# Altium project STM32H747IGT6_IsolatedDAQ.PrjPcb
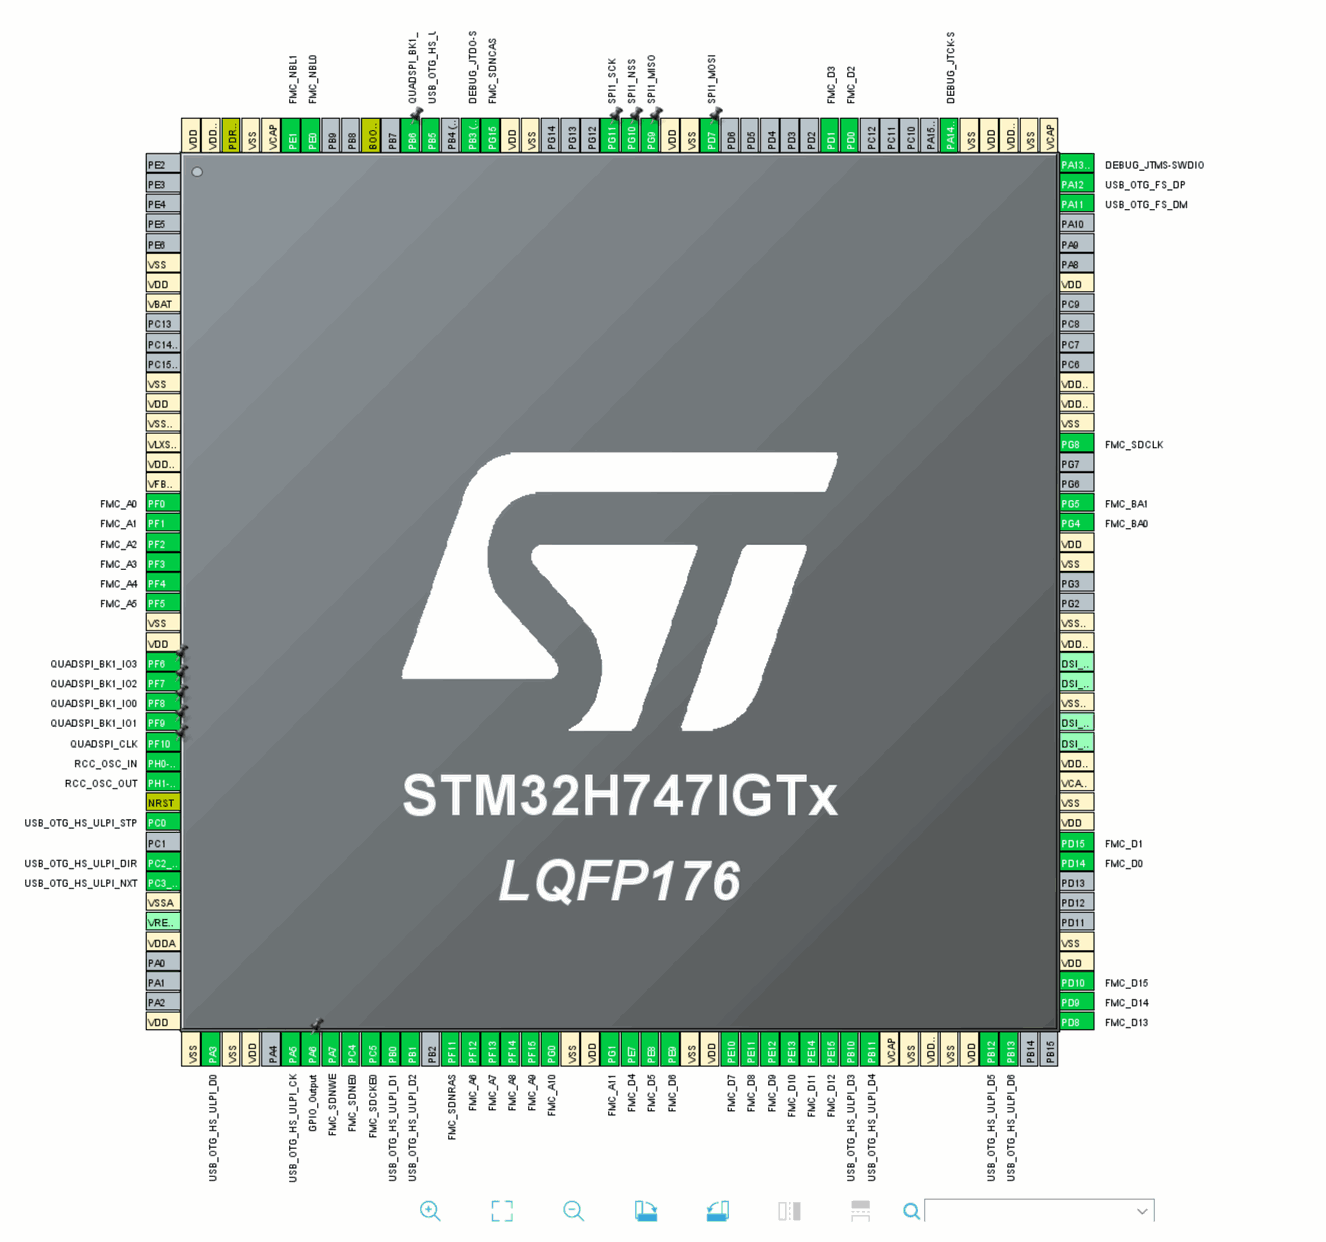
[diagram p0: MCU_Overview.SchDoc]
9 sheets, 159 parts. Net scope: global (net labels, ports and power ports of the same name join across sheets).
Board file: IsolatedDAQ.PcbDoc
Sheets:
  MCU_Overview.SchDoc
  PowerSupply.SchDoc
  Decoupling.SchDoc
  MCUConfig.SchDoc
  SDRAMModule.SchDoc
  GPIOPins.SchDoc
  USBHSULPI.SchDoc
  IsolationBarriers.SchDoc
  MultiChannelADC.SchDoc

## Sheet MCU_Overview.SchDoc
size A3; SheetNumber: 1; SheetTotal: 8

## Sheet PowerSupply.SchDoc
size A4; SheetNumber: 2; SheetTotal: 9
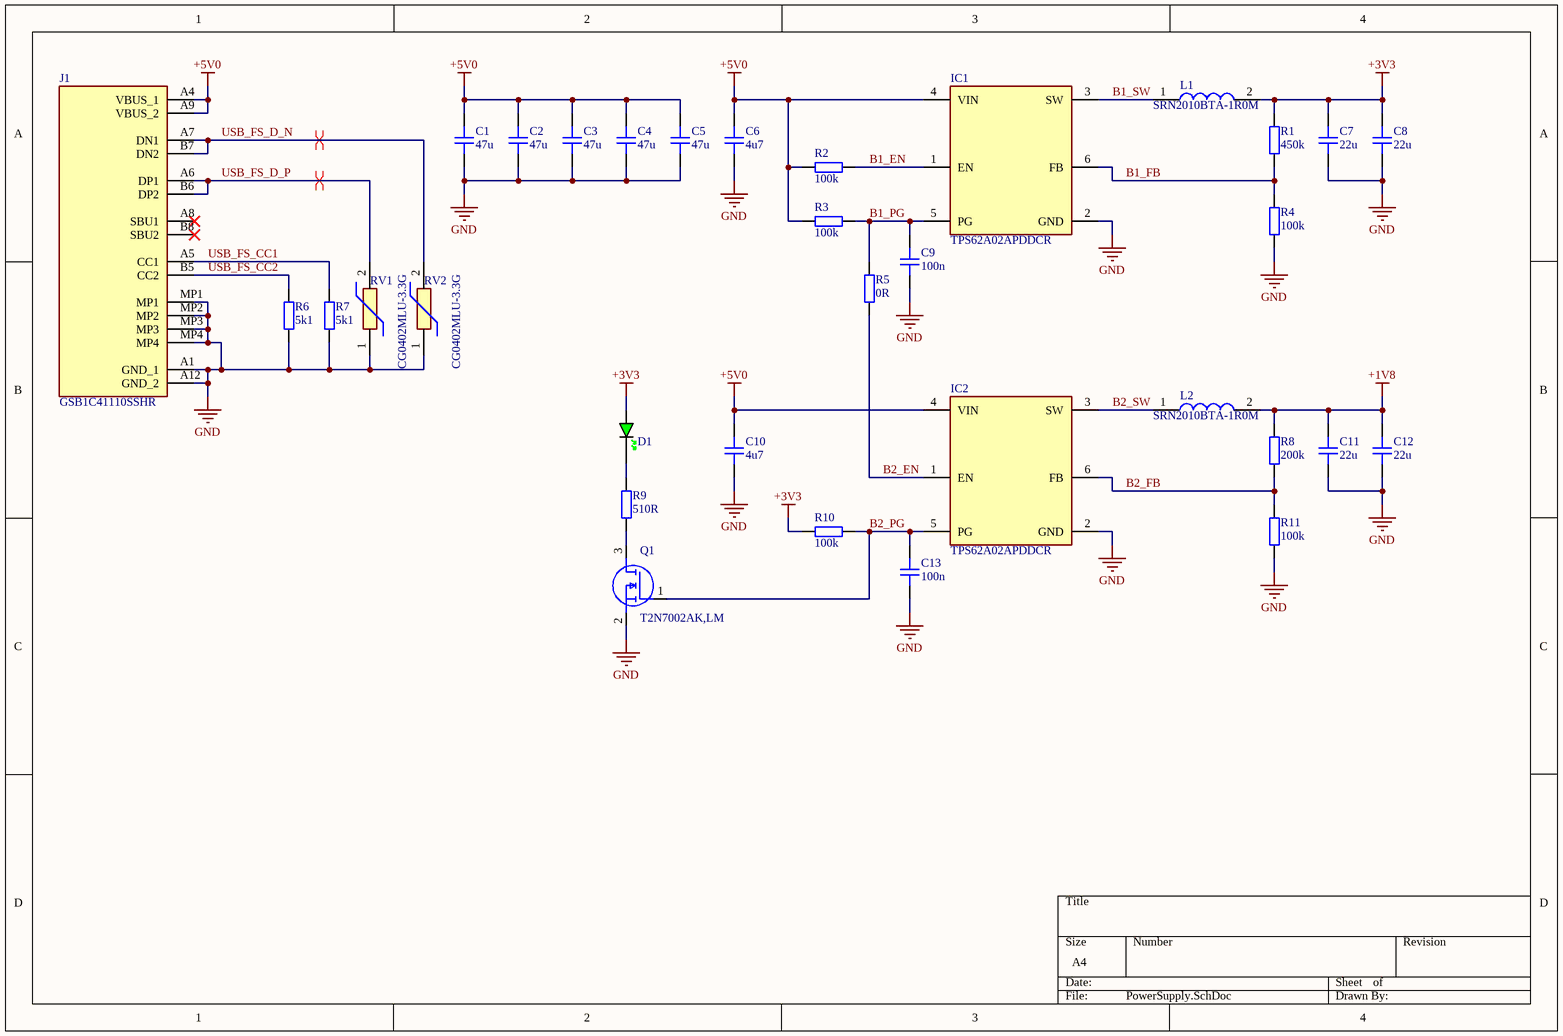
[diagram p1: PowerSupply.SchDoc]

### Parts
C1  47u  [CAP_1210]
C2  47u  [CAP_1210]
C3  47u  [CAP_1210]
C4  47u  [CAP_1210]
C5  47u  [CAP_1210]
C6  4u7  [CAP_0603]
C7  22u  [CAP_0603]
C8  22u  [CAP_0603]
C9  100n  [CAP_0402]
C10  4u7  [CAP_0603]
C11  22u  [CAP_0603]
C12  22u  [CAP_0603]
C13  100n  [CAP_0402]
D1  GREEN  [LED_0603_GREEN]  (value not drawn)
IC1  TPS62A02APDDCR  [SOT95P280X110-6N - duplicate]
IC2  TPS62A02APDDCR  [SOT95P280X110-6N - duplicate]
J1  GSB1C41110SSHR  [GSB1C41110SSHR]
L1  SRN2010BTA-1R0M  [SRN2010BTA1R0M]
L2  SRN2010BTA-1R0M  [SRN2010BTA1R0M]
Q1  T2N7002AK,LM  [TBAT54CLM]
R1  450k  [RES_0402]
R2  100k  [RES_0402]
R3  100k  [RES_0402]
R4  100k  [RES_0402]
R5  0R  [RES_0402]
R6  5k1  [RES_0402]
R7  5k1  [RES_0402]
R8  200k  [RES_0402]
R9  510R  [RES_0603]
R10  100k  [RES_0402]
R11  100k  [RES_0402]
RV1  CG0402MLU-3.3G  [VARC1005X41N]
RV2  CG0402MLU-3.3G  [VARC1005X41N]

### Nets
+1V8: C11.2 C12.2 L2.2 R8.2
+3V3: C7.2 C8.2 D1.A L1.2 R1.2 R10.1
+5V0: C1.2 C2.2 C3.2 C4.2 C5.2 C6.2 C10.2 IC1.4(VIN) IC2.4(VIN) J1.A4(VBUS_1) J1.A9(VBUS_2) R2.1 R3.1
GND: C1.1 C2.1 C3.1 C4.1 C5.1 C6.1 C7.1 C8.1 C9.1 C10.1 C11.1 C12.1 C13.1 IC1.2(GND) IC2.2(GND) J1.A1(GND_1) J1.A12(GND_2) J1.MP1 J1.MP2 J1.MP3 J1.MP4 Q1.2(S) R4.1 R6.2 R7.2 R11.1 RV1.1 RV2.1
B1_EN: IC1.1(EN) R2.2
B1_FB: IC1.6(FB) R1.1 R4.2
B1_PG: C9.2 IC1.5(PG) R3.2 R5.2
B1_SW: IC1.3(SW) L1.1
B2_EN: IC2.1(EN) R5.1
B2_FB: IC2.6(FB) R8.1 R11.2
B2_PG: C13.2 IC2.5(PG) Q1.1(G) R10.2
B2_SW: IC2.3(SW) L2.1
USB_FS_CC1: J1.A5(CC1) R7.1
USB_FS_CC2: J1.B5(CC2) R6.1
USB_FS_D_N: J1.A7(DN1) J1.B7(DN2) RV2.2
USB_FS_D_P: J1.A6(DP1) J1.B6(DP2) RV1.2
NetD1_K: D1.K R9.2
NetQ1_3: Q1.3(D) R9.1

Not connected (* = marked no-connect by the designer): J1 A8(SBU1)* B8(SBU2)*

### Layout directives
differential pair: USB_FS_D_N, USB_FS_D_P

### Library data of the parts
C1-C5 = CAP_1210: Capacitor SMD 1210; Manufacturer: *; Manufacturer Part Number: *; Distributor Link: *; LCSC: *; Rating: *; Dielectric: *
C6-C8 C10-C12 = CAP_0603: Capacitor SMD 0603; Manufacturer: *; Manufacturer Part Number: *; Distributor Link: *; LCSC: *; Rating: *; Dielectric: *
C9 C13 = CAP_0402: Capacitor SMD 0402; Manufacturer: *; Manufacturer Part Number: *; Distributor Link: *; LCSC: *; Rating: *; Dielectric: *
D1 = LED_0603_GREEN: LED 0603 GREEN SMD
IC1 IC2 = TPS62A02APDDCR: Integrated Circuit; Manufacturer_Name: Texas Instruments; Datasheet Link: https://www.ti.com/lit/ds/symlink/tps62a02a.pdf?ts=1731815729746&ref_url=https%253A%252F%252Fwww.ti.com%252Fproduct%252FTPS62A02A%252Fpart-details%252FTPS62A02APDDCR%253Futm_source%253Dgoogle%2526utm_medium%253Dcpc%2526utm_campaign%253Docb-tistore-null-ap; Height: 1.1mm; Manufacturer_Part_Number: TPS62A02APDDCR; Mouser Part Number: 595-TPS62A02APDDCR; Mouser Price/Stock: https://www.mouser.co.uk/ProductDetail/Texas-Instruments/TPS62A02APDDCR?qs=ZcfC38r4PotJY8Nb5BNo3Q%3D%3D; Arrow Part Number: TPS62A02APDDCR; Arrow Price/Stock: https://www.arrow.com/en/products/tps62a02apddcr/texas-instruments?utm_currency=USD&region=nac
J1 = GSB1C41110SSHR: Connector; Manufacturer_Name: Amphenol Communications Solutions; Datasheet Link: https://cdn.amphenol-cs.com/media/wysiwyg/files/drawing/gsb1c41x10sshr-ax1.pdf; Height: 3.41mm; Manufacturer_Part_Number: GSB1C41110SSHR
L1 L2 = SRN2010BTA-1R0M: Inductor; Manufacturer_Name: Bourns; Datasheet Link: https://www.bourns.com/docs/Product-Datasheets/SRN2010BTA.pdf; Height: 1mm; Manufacturer_Part_Number: SRN2010BTA-1R0M
Q1 = T2N7002AK,LM: MOSFET (N-Channel); Manufacturer_Name: Toshiba; Datasheet Link: http://toshiba.semicon-storage.com/info/docget.jsp?did=29712&prodName=T2N7002AK; Height: 1.1mm; Manufacturer_Part_Number: T2N7002AK,LM; Mouser Part Number: 757-T2N7002AKLM; Mouser Price/Stock: https://www.mouser.co.uk/ProductDetail/Toshiba/T2N7002AKLM?qs=pzVvXTvk9PzfX4hYglwZ9Q%3D%3D; Arrow Part Number: T2N7002AK,LM; Arrow Price/Stock: https://www.arrow.com/en/products/t2n7002aklm/toshiba?region=nac
R1-R8 R10 R11 = RES_0402: Resistor SMD 0402; Manufacturer: *; Manufacturer Part Number: *; Distributor Link: *; LCSC: *
R9 = RES_0603: Resistor SMD 0603; Manufacturer: *; Manufacturer Part Number: *; Distributor Link: *; LCSC: *
RV1 RV2 = CG0402MLU-3.3G: ESD Diode; Manufacturer_Name: Bourns; Datasheet Link: https://www.bourns.com/docs/Product-Datasheets/MLU.pdf; Height: 0.41mm; Manufacturer_Part_Number: CG0402MLU-3.3G; Mouser Part Number: 652-CG0402MLU-3.3G; Mouser Price/Stock: https://www.mouser.co.uk/ProductDetail/Bourns/CG0402MLU-3.3G?qs=m8myXnDJXpWVM8EQWErxtQ%3D%3D; Arrow Part Number: CG0402MLU-3.3G; Arrow Price/Stock: https://www.arrow.com/en/products/cg0402mlu-3.3g/bourns?utm_currency=USD&region=nac

## Sheet Decoupling.SchDoc
size A4; SheetNumber: 3; SheetTotal: 8
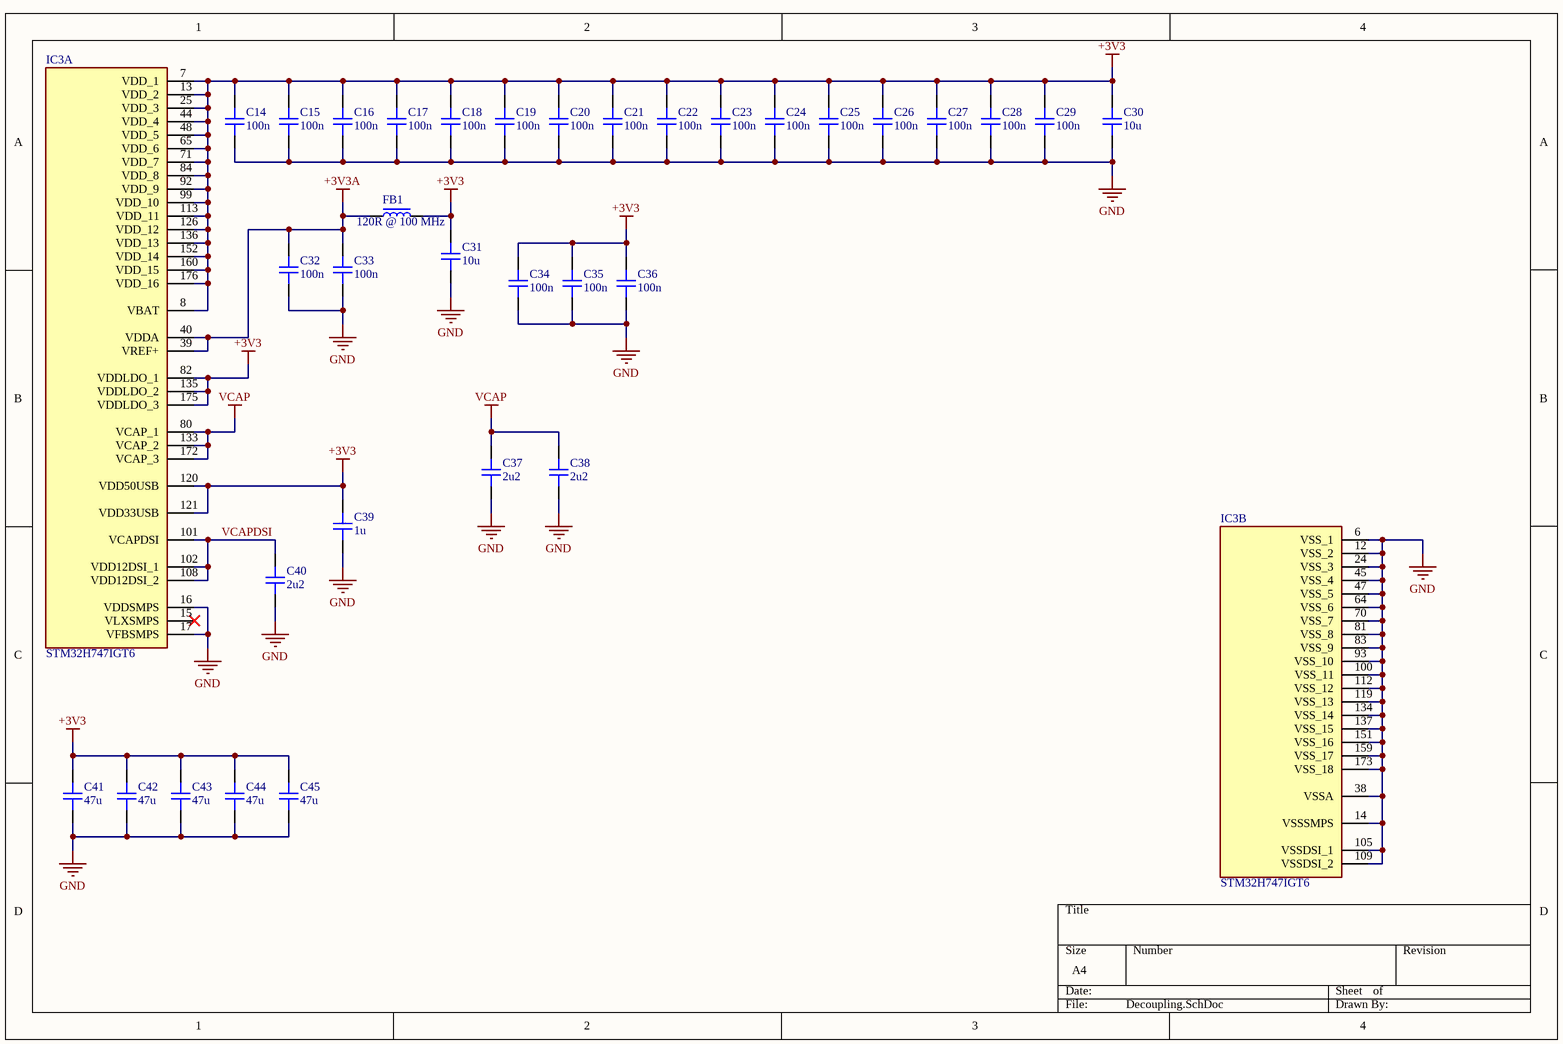
[diagram p2: Decoupling.SchDoc]

### Parts
C14  100n  [CAP_0402]
C15  100n  [CAP_0402]
C16  100n  [CAP_0402]
C17  100n  [CAP_0402]
C18  100n  [CAP_0402]
C19  100n  [CAP_0402]
C20  100n  [CAP_0402]
C21  100n  [CAP_0402]
C22  100n  [CAP_0402]
C23  100n  [CAP_0402]
C24  100n  [CAP_0402]
C25  100n  [CAP_0402]
C26  100n  [CAP_0402]
C27  100n  [CAP_0402]
C28  100n  [CAP_0402]
C29  100n  [CAP_0402]
C30  10u  [CAP_0603]
C31  10u  [CAP_0603]
C32  100n  [CAP_0402]
C33  100n  [CAP_0402]
C34  100n  [CAP_0402]
C35  100n  [CAP_0402]
C36  100n  [CAP_0402]
C37  2u2  [CAP_0402]
C38  2u2  [CAP_0402]
C39  1u  [CAP_0402]
C40  2u2  [CAP_0402]
C41  47u  [CAP_1210]
C42  47u  [CAP_1210]
C43  47u  [CAP_1210]
C44  47u  [CAP_1210]
C45  47u  [CAP_1210]
FB1  120R @ 100 MHz  [FB_0402]
IC3  STM32H747IGT6  [QFP50P2600X2600X160-176N]  (parts A,B of 10)

### Nets
+3V3: C14.2 C15.2 C16.2 C17.2 C18.2 C19.2 C20.2 C21.2 C22.2 C23.2 C24.2 C25.2 C26.2 C27.2 C28.2 C29.2 C30.2 C31.2 C34.2 C35.2 C36.2 C39.2 C41.2 C42.2 C43.2 C44.2 C45.2 FB1.2 IC3.7(VDD_1) IC3.8(VBAT) IC3.13(VDD_2) IC3.25(VDD_3) IC3.44(VDD_4) IC3.48(VDD_5) IC3.65(VDD_6) IC3.71(VDD_7) IC3.82(VDDLDO_1) IC3.84(VDD_8) IC3.92(VDD_9) IC3.99(VDD_10) IC3.113(VDD_11) IC3.120(VDD50USB) IC3.121(VDD33USB) IC3.126(VDD_12) IC3.135(VDDLDO_2) IC3.136(VDD_13) IC3.152(VDD_14) IC3.160(VDD_15) IC3.175(VDDLDO_3) IC3.176(VDD_16)
+3V3A: C32.2 C33.2 FB1.1 IC3.39(VREF+) IC3.40(VDDA)
GND: C14.1 C15.1 C16.1 C17.1 C18.1 C19.1 C20.1 C21.1 C22.1 C23.1 C24.1 C25.1 C26.1 C27.1 C28.1 C29.1 C30.1 C31.1 C32.1 C33.1 C34.1 C35.1 C36.1 C37.1 C38.1 C39.1 C40.1 C41.1 C42.1 C43.1 C44.1 C45.1 IC3.6(VSS_1) IC3.12(VSS_2) IC3.14(VSSSMPS) IC3.16(VDDSMPS) IC3.17(VFBSMPS) IC3.24(VSS_3) IC3.38(VSSA) IC3.45(VSS_4) IC3.47(VSS_5) IC3.64(VSS_6) IC3.70(VSS_7) IC3.81(VSS_8) IC3.83(VSS_9) IC3.93(VSS_10) IC3.100(VSS_11) IC3.105(VSSDSI_1) IC3.109(VSSDSI_2) IC3.112(VSS_12) IC3.119(VSS_13) IC3.134(VSS_14) IC3.137(VSS_15) IC3.151(VSS_16) IC3.159(VSS_17) IC3.173(VSS_18)
VCAP: C37.2 C38.2 IC3.80(VCAP_1) IC3.133(VCAP_2) IC3.172(VCAP_3)
VCAPDSI: C40.2 IC3.101(VCAPDSI) IC3.102(VDD12DSI_1) IC3.108(VDD12DSI_2)

Not connected (* = marked no-connect by the designer): IC3 15(VLXSMPS)*

### Library data of the parts
C14-C29 C32-C40 = CAP_0402: Capacitor SMD 0402; Manufacturer: *; Manufacturer Part Number: *; Distributor Link: *; LCSC: *; Rating: *; Dielectric: *
C30 C31 = CAP_0603: Capacitor SMD 0603; Manufacturer: *; Manufacturer Part Number: *; Distributor Link: *; LCSC: *; Rating: *; Dielectric: *
C41-C45 = CAP_1210: Capacitor SMD 1210; Manufacturer: *; Manufacturer Part Number: *; Distributor Link: *; LCSC: *; Rating: *; Dielectric: *
FB1 = FB_0402: Ferrite Bead SMD 0402; Manufacturer: *; Manufacturer Part Number: *; Distributor Link: *; LCSC: *
IC3 = STM32H747IGT6: Integrated Circuit; Manufacturer_Name: STMicroelectronics; Datasheet Link: https://www.mouser.com/datasheet/2/389/dm00602212-1799407.pdf; Height: 1.6mm; Manufacturer_Part_Number: STM32H747IGT6; Mouser Part Number: 511-STM32H747IGT6; Mouser Price/Stock: https://www.mouser.co.uk/ProductDetail/STMicroelectronics/STM32H747IGT6?qs=%252B6g0mu59x7Kw%252BsPEalqvLg%3D%3D; Arrow Part Number: STM32H747IGT6; Arrow Price/Stock: null?region=nac

## Sheet MCUConfig.SchDoc
size A4; SheetNumber: 4; SheetTotal: 8
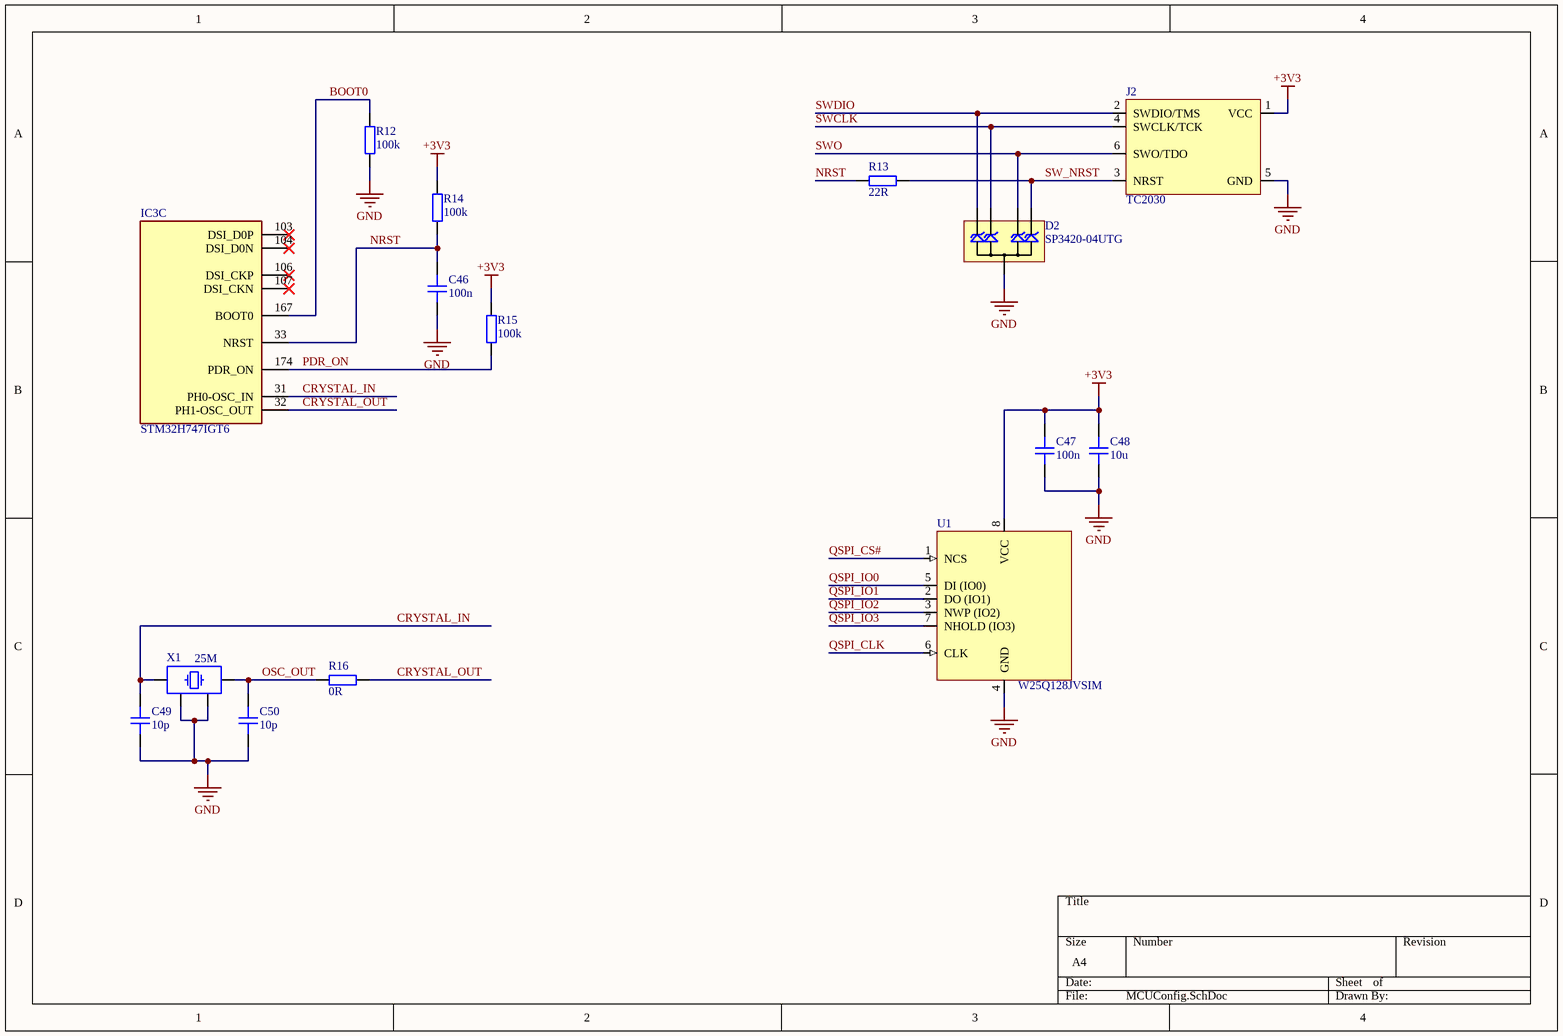
[diagram p3: MCUConfig.SchDoc]

### Parts
C46  100n  [CAP_0402]
C47  100n  [CAP_0402]
C48  10u  [CAP_0603]
C49  10p  [CAP_0402]
C50  10p  [CAP_0402]
D2  SP3420-04UTG  [uDFN-10]
IC3  STM32H747IGT6  [QFP50P2600X2600X160-176N]  (part C of 10)
J2  TC2030  [TC2030-FP]  (no BOM)
R12  100k  [RES_0402]
R13  22R  [RES_0402]
R14  100k  [RES_0402]
R15  100k  [RES_0402]
R16  0R  [RES_0402]
U1  W25Q128JVSIM  [SOIC-8]
X1  25M  [XTAL_3225]

### Nets
+3V3: C47.2 C48.2 J2.1(VCC) R14.2 R15.2 U1.8(VCC)
GND: C46.1 C47.1 C48.1 C49.1 C50.1 D2.38(GND) J2.5(GND) R12.1 U1.4(GND) X1.2 X1.4
BOOT0: IC3.167(BOOT0) R12.2
CRYSTAL_IN: C49.2 IC3.31(PH0-OSC_IN) X1.1
CRYSTAL_OUT: IC3.32(PH1-OSC_OUT) R16.2
NRST: C46.2 IC3.33(NRST) R13.2 R14.1
OSC_OUT: C50.2 R16.1 X1.3
PDR_ON: IC3.174(PDR_ON) R15.1
QSPI_CLK: U1.6(CLK)
QSPI_CS#: U1.1(NCS)
QSPI_IO0: U1.5(DI_(IO0))
QSPI_IO1: U1.2(DO_(IO1))
QSPI_IO2: U1.3(NWP_(IO2))
QSPI_IO3: U1.7(NHOLD_(IO3))
SW_NRST: D2.56 J2.3(NRST) R13.1
SWCLK: D2.29 J2.4(SWCLK/TCK)
SWDIO: D2.110 J2.2(SWDIO/TMS)
SWO: D2.47 J2.6(SWO/TDO)

Not connected (* = marked no-connect by the designer): IC3 103(DSI_D0P)* 104(DSI_D0N)* 106(DSI_CKP)* 107(DSI_CKN)*

### Library data of the parts
C46 C47 C49 C50 = CAP_0402: Capacitor SMD 0402; Manufacturer: *; Manufacturer Part Number: *; Distributor Link: *; LCSC: *; Rating: *; Dielectric: *
C48 = CAP_0603: Capacitor SMD 0603; Manufacturer: *; Manufacturer Part Number: *; Distributor Link: *; LCSC: *; Rating: *; Dielectric: *
D2 = SP3420-04UTG: TVS Diode Array Low Capacitance ESD Protection 4-Channel (Vwork=3V3, Vclamp=6V); Manufacturer: Littelfuse; Manufacturer Part Number: SP3420-04UTG
IC3 = STM32H747IGT6: as IC3 on sheet Decoupling; Datasheet Link: https://www.mouser.com/datasheet/2/389/dm00602212-1799407.pdf; Height: 1.6mm; Manufacturer_Part_Number: STM32H747IGT6; Mouser Part Number: 511-STM32H747IGT6; Mouser Price/Stock: https://www.mouser.co.uk/ProductDetail/STMicroelectronics/STM32H747IGT6?qs=%252B6g0mu59x7Kw%252BsPEalqvLg%3D%3D; Arrow Part Number: STM32H747IGT6; Arrow Price/Stock: null?region=nac
J2 = TC2030: Tag-Connect No-Solder SWD Debug Connector DO NOT PLACE; Manufacturer: Tag-Connect; Manufacturer Part Number: TC2030
R12-R16 = RES_0402: Resistor SMD 0402; Manufacturer: *; Manufacturer Part Number: *; Distributor Link: *; LCSC: *
U1 = W25Q128JVSIM: 128M-BIT / SERIAL FLASH MEMORY WITH / DUAL/QUAD SPI & QPI & DTR SOIC-8; Manufacturer: Winbond; Manufacturer Part Number: W25Q128JVSIM
X1 = XTAL_3225: Crystal SMD 3225; Distributor Link: *

## Sheet SDRAMModule.SchDoc
size A4; SheetNumber: 5; SheetTotal: 8
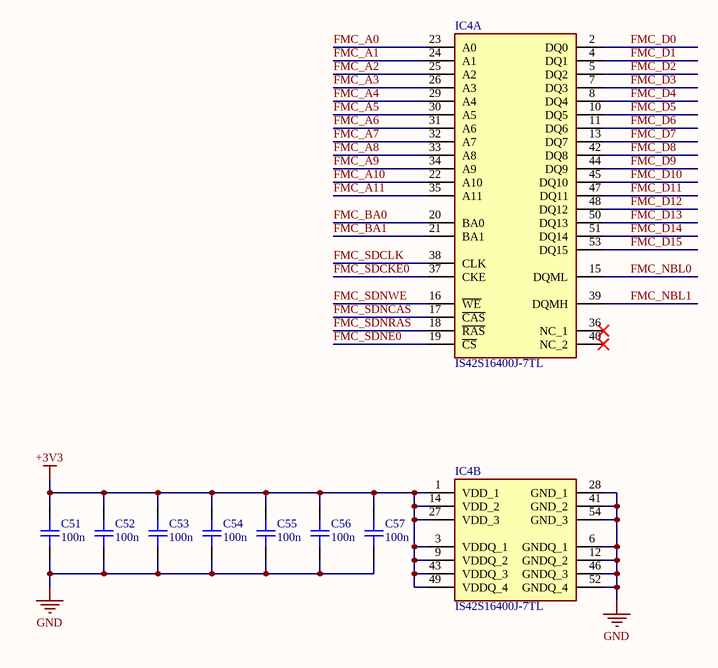
[diagram p4: SDRAMModule.SchDoc]

### Parts
C51  100n  [CAP_0402]
C52  100n  [CAP_0402]
C53  100n  [CAP_0402]
C54  100n  [CAP_0402]
C55  100n  [CAP_0402]
C56  100n  [CAP_0402]
C57  100n  [CAP_0402]
IC4  IS42S16400J-7TL  [SOP80P1176X120-54N]  (parts A,B of 2)

### Nets
+3V3: C51.2 C52.2 C53.2 C54.2 C55.2 C56.2 C57.2 IC4.1(VDD_1) IC4.3(VDDQ_1) IC4.9(VDDQ_2) IC4.14(VDD_2) IC4.27(VDD_3) IC4.43(VDDQ_3) IC4.49(VDDQ_4)
GND: C51.1 C52.1 C53.1 C54.1 C55.1 C56.1 C57.1 IC4.6(GNDQ_1) IC4.12(GNDQ_2) IC4.28(GND_1) IC4.41(GND_2) IC4.46(GNDQ_3) IC4.52(GNDQ_4) IC4.54(GND_3)
FMC_A0: IC4.23(A0)
FMC_A1: IC4.24(A1)
FMC_A2: IC4.25(A2)
FMC_A3: IC4.26(A3)
FMC_A4: IC4.29(A4)
FMC_A5: IC4.30(A5)
FMC_A6: IC4.31(A6)
FMC_A7: IC4.32(A7)
FMC_A8: IC4.33(A8)
FMC_A9: IC4.34(A9)
FMC_A10: IC4.22(A10)
FMC_A11: IC4.35(A11)
FMC_BA0: IC4.20(BA0)
FMC_BA1: IC4.21(BA1)
FMC_D0: IC4.2(DQ0)
FMC_D1: IC4.4(DQ1)
FMC_D2: IC4.5(DQ2)
FMC_D3: IC4.7(DQ3)
FMC_D4: IC4.8(DQ4)
FMC_D5: IC4.10(DQ5)
FMC_D6: IC4.11(DQ6)
FMC_D7: IC4.13(DQ7)
FMC_D8: IC4.42(DQ8)
FMC_D9: IC4.44(DQ9)
FMC_D10: IC4.45(DQ10)
FMC_D11: IC4.47(DQ11)
FMC_D12: IC4.48(DQ12)
FMC_D13: IC4.50(DQ13)
FMC_D14: IC4.51(DQ14)
FMC_D15: IC4.53(DQ15)
FMC_NBL0: IC4.15(DQML)
FMC_NBL1: IC4.39(DQMH)
FMC_SDCKE0: IC4.37(CKE)
FMC_SDCLK: IC4.38(CLK)
FMC_SDNCAS: IC4.17(~{CAS})
FMC_SDNE0: IC4.19(~{CS})
FMC_SDNRAS: IC4.18(~{RAS})
FMC_SDNWE: IC4.16(~{WE})

Not connected (* = marked no-connect by the designer): IC4 36(NC_1)* 40(NC_2)*

### Library data of the parts
C51-C57 = CAP_0402: Capacitor SMD 0402; Manufacturer: *; Manufacturer Part Number: *; Distributor Link: *; LCSC: *; Rating: *; Dielectric: *
IC4 = IS42S16400J-7TL: Integrated Circuit; Manufacturer_Name: Integrated Silicon Solution Inc.; Datasheet Link: http://www.issi.com/WW/pdf/42-45S16400J.pdf; Height: 1.2mm; Manufacturer_Part_Number: IS42S16400J-7TL; Mouser Part Number: 870-IS42S16400J-7TL; Mouser Price/Stock: https://www.mouser.co.uk/ProductDetail/ISSI/IS42S16400J-7TL?qs=eOmjsnl%2FhF6%2FoT1%252B3blFIA%3D%3D; Arrow Part Number: IS42S16400J-7TL; Arrow Price/Stock: https://www.arrow.com/en/products/is42s16400j-7tl/integrated-silicon-solution-inc?region=europe

## Sheet GPIOPins.SchDoc
size A4; SheetNumber: 6; SheetTotal: 8
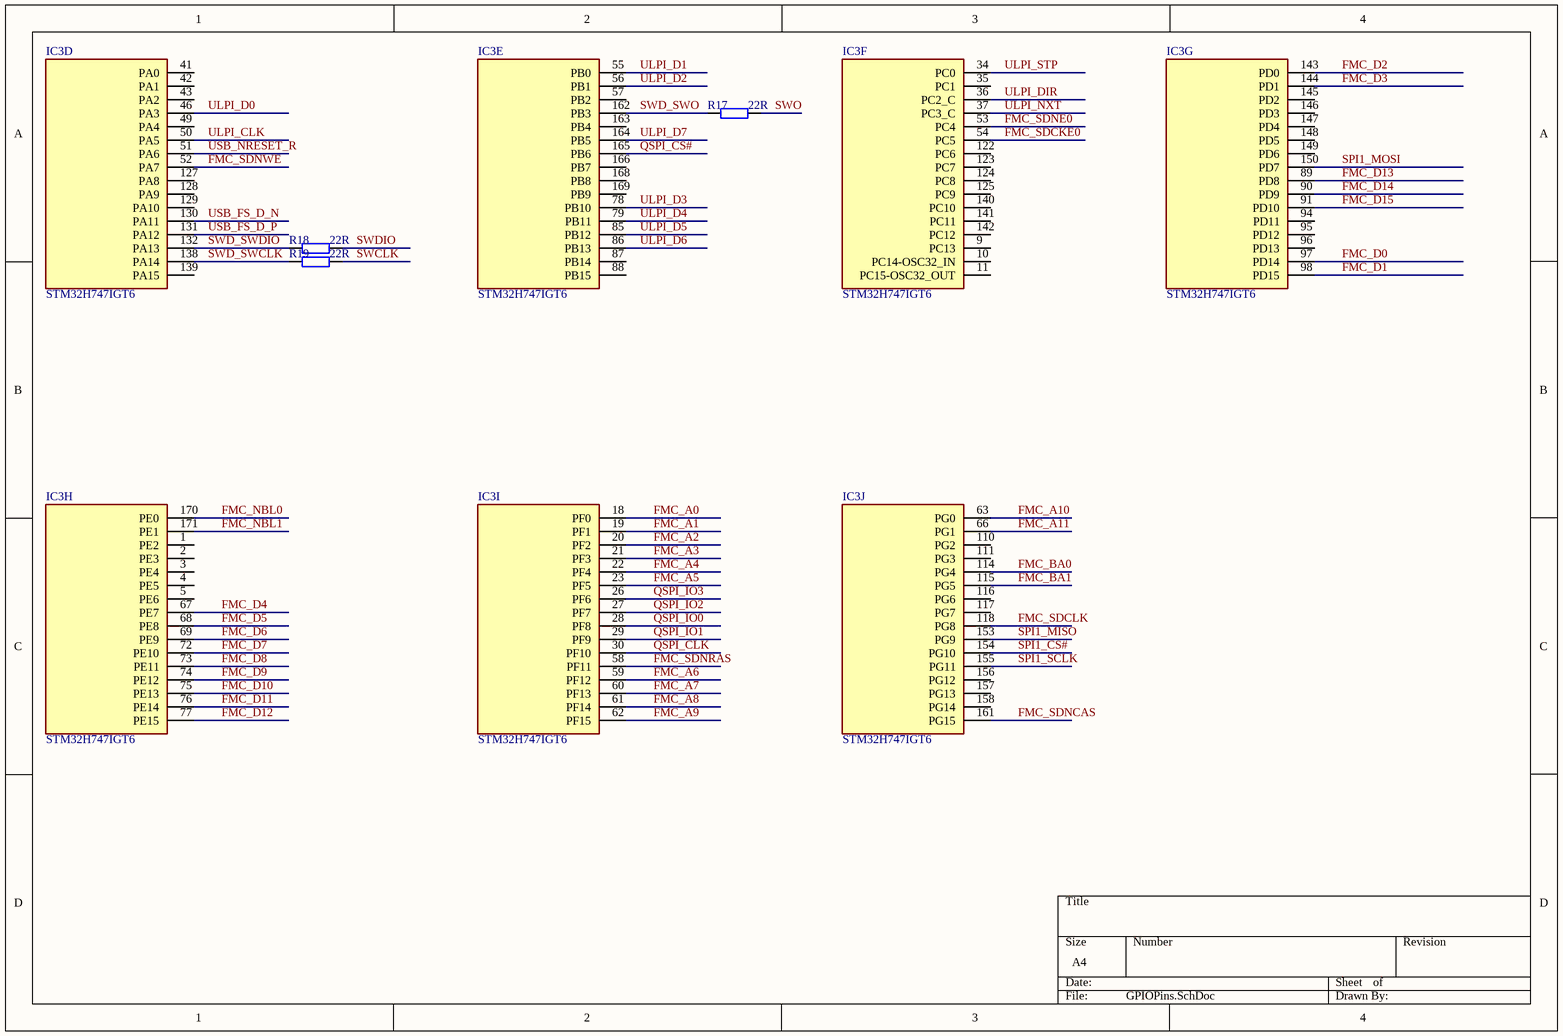
[diagram p5: GPIOPins.SchDoc]

### Parts
IC3  STM32H747IGT6  [QFP50P2600X2600X160-176N]  (parts D,E,F,G,H,I,J of 10)
R17  22R  [RES_0402]
R18  22R  [RES_0402]
R19  22R  [RES_0402]

### Nets
FMC_A0: IC3.18(PF0)
FMC_A1: IC3.19(PF1)
FMC_A2: IC3.20(PF2)
FMC_A3: IC3.21(PF3)
FMC_A4: IC3.22(PF4)
FMC_A5: IC3.23(PF5)
FMC_A6: IC3.59(PF12)
FMC_A7: IC3.60(PF13)
FMC_A8: IC3.61(PF14)
FMC_A9: IC3.62(PF15)
FMC_A10: IC3.63(PG0)
FMC_A11: IC3.66(PG1)
FMC_BA0: IC3.114(PG4)
FMC_BA1: IC3.115(PG5)
FMC_D0: IC3.97(PD14)
FMC_D1: IC3.98(PD15)
FMC_D2: IC3.143(PD0)
FMC_D3: IC3.144(PD1)
FMC_D4: IC3.67(PE7)
FMC_D5: IC3.68(PE8)
FMC_D6: IC3.69(PE9)
FMC_D7: IC3.72(PE10)
FMC_D8: IC3.73(PE11)
FMC_D9: IC3.74(PE12)
FMC_D10: IC3.75(PE13)
FMC_D11: IC3.76(PE14)
FMC_D12: IC3.77(PE15)
FMC_D13: IC3.89(PD8)
FMC_D14: IC3.90(PD9)
FMC_D15: IC3.91(PD10)
FMC_NBL0: IC3.170(PE0)
FMC_NBL1: IC3.171(PE1)
FMC_SDCKE0: IC3.54(PC5)
FMC_SDCLK: IC3.118(PG8)
FMC_SDNCAS: IC3.161(PG15)
FMC_SDNE0: IC3.53(PC4)
FMC_SDNRAS: IC3.58(PF11)
FMC_SDNWE: IC3.52(PA7)
QSPI_CLK: IC3.30(PF10)
QSPI_CS#: IC3.165(PB6)
QSPI_IO0: IC3.28(PF8)
QSPI_IO1: IC3.29(PF9)
QSPI_IO2: IC3.27(PF7)
QSPI_IO3: IC3.26(PF6)
SPI1_CS#: IC3.154(PG10)
SPI1_MISO: IC3.153(PG9)
SPI1_MOSI: IC3.150(PD7)
SPI1_SCLK: IC3.155(PG11)
SWCLK: R19.1
SWD_SWCLK: IC3.138(PA14) R19.2
SWD_SWDIO: IC3.132(PA13) R18.2
SWD_SWO: IC3.162(PB3) R17.2
SWDIO: R18.1
SWO: R17.1
ULPI_CLK: IC3.50(PA5)
ULPI_D0: IC3.46(PA3)
ULPI_D1: IC3.55(PB0)
ULPI_D2: IC3.56(PB1)
ULPI_D3: IC3.78(PB10)
ULPI_D4: IC3.79(PB11)
ULPI_D5: IC3.85(PB12)
ULPI_D6: IC3.86(PB13)
ULPI_D7: IC3.164(PB5)
ULPI_DIR: IC3.36(PC2_C)
ULPI_NXT: IC3.37(PC3_C)
ULPI_STP: IC3.34(PC0)
USB_FS_D_N: IC3.130(PA11)
USB_FS_D_P: IC3.131(PA12)
USB_NRESET_R: IC3.51(PA6)

Not connected (* = marked no-connect by the designer): IC3 1(PE2) 2(PE3) 3(PE4) 4(PE5) 5(PE6) 9(PC13) 10(PC14-OSC32_IN) 11(PC15-OSC32_OUT) 35(PC1) 41(PA0) 42(PA1) 43(PA2) 49(PA4) 57(PB2) 87(PB14) 88(PB15) 94(PD11) 95(PD12) 96(PD13) 110(PG2) 111(PG3) 116(PG6) 117(PG7) 122(PC6) 123(PC7) 124(PC8) 125(PC9) 127(PA8) 128(PA9) 129(PA10) 139(PA15) 140(PC10) 141(PC11) 142(PC12) 145(PD2) 146(PD3) 147(PD4) 148(PD5) 149(PD6) 156(PG12) 157(PG13) 158(PG14) 163(PB4) 166(PB7) 168(PB8) 169(PB9)

### Library data of the parts
IC3 = STM32H747IGT6: as IC3 on sheet Decoupling; Datasheet Link: https://www.mouser.com/datasheet/2/389/dm00602212-1799407.pdf; Height: 1.6mm; Manufacturer_Part_Number: STM32H747IGT6; Mouser Part Number: 511-STM32H747IGT6; Mouser Price/Stock: https://www.mouser.co.uk/ProductDetail/STMicroelectronics/STM32H747IGT6?qs=%252B6g0mu59x7Kw%252BsPEalqvLg%3D%3D; Arrow Part Number: STM32H747IGT6; Arrow Price/Stock: null?region=nac
R17-R19 = RES_0402: Resistor SMD 0402; Manufacturer: *; Manufacturer Part Number: *; Distributor Link: *; LCSC: *

## Sheet USBHSULPI.SchDoc
size A4; SheetNumber: 7; SheetTotal: 9
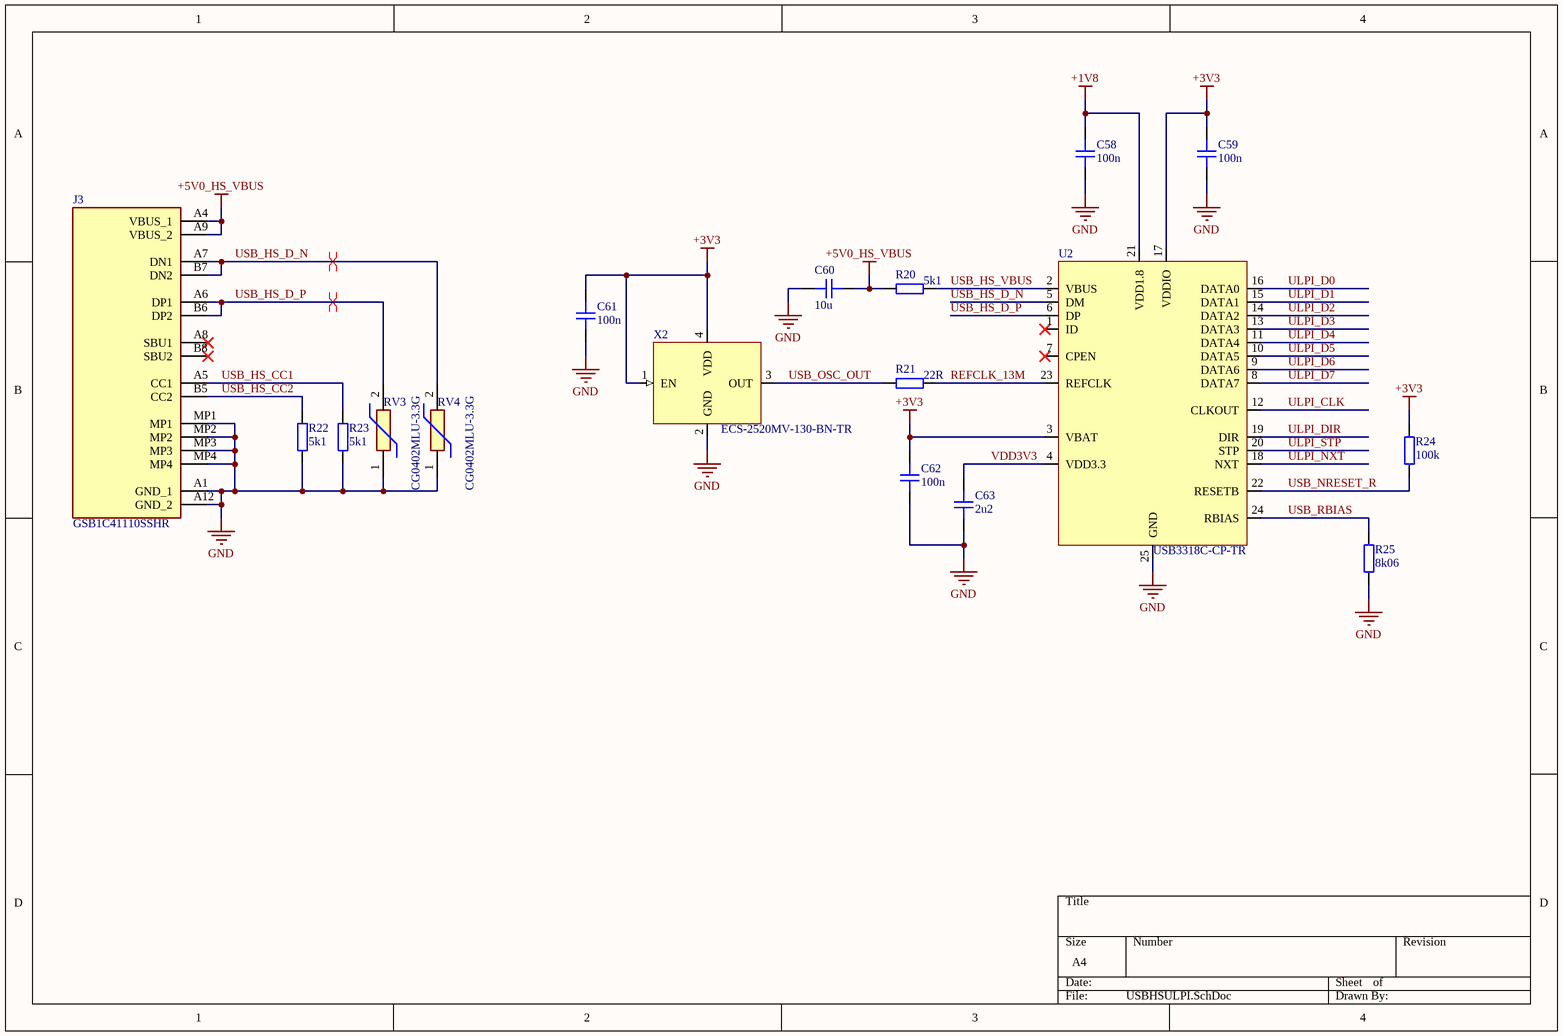
[diagram p6: USBHSULPI.SchDoc]

### Parts
C58  100n  [CAP_0402]
C59  100n  [CAP_0402]
C60  10u  [CAP_0603]
C61  100n  [CAP_0402]
C62  100n  [CAP_0402]
C63  2u2  [CAP_0402]
J3  GSB1C41110SSHR  [GSB1C41110SSHR]
R20  5k1  [RES_0402]
R21  22R  [RES_0402]
R22  5k1  [RES_0402]
R23  5k1  [RES_0402]
R24  100k  [RES_0402]
R25  8k06  [RES_0402]
RV3  CG0402MLU-3.3G  [VARC1005X41N]
RV4  CG0402MLU-3.3G  [VARC1005X41N]
U2  USB3318C-CP-TR  [QFN50P400X400X100-25N-D]
X2  ECS-2520MV-130-BN-TR  [XTAL_2520]

### Nets
+1V8: C58.2 U2.21(VDD1.8)
+3V3: C59.2 C61.2 C62.2 R24.1 U2.3(VBAT) U2.17(VDDIO) X2.1(EN) X2.4(VDD)
+5V0_HS_VBUS: C60.1 J3.A4(VBUS_1) J3.A9(VBUS_2) R20.2
GND: C58.1 C59.1 C60.2 C61.1 C62.1 C63.1 J3.A1(GND_1) J3.A12(GND_2) J3.MP1 J3.MP2 J3.MP3 J3.MP4 R22.2 R23.2 R25.1 RV3.1 RV4.1 U2.25(GND) X2.2(GND)
REFCLK_13M: R21.1 U2.23(REFCLK)
ULPI_CLK: U2.12(CLKOUT)
ULPI_D0: U2.16(DATA0)
ULPI_D1: U2.15(DATA1)
ULPI_D2: U2.14(DATA2)
ULPI_D3: U2.13(DATA3)
ULPI_D4: U2.11(DATA4)
ULPI_D5: U2.10(DATA5)
ULPI_D6: U2.9(DATA6)
ULPI_D7: U2.8(DATA7)
ULPI_DIR: U2.19(DIR)
ULPI_NXT: U2.18(NXT)
ULPI_STP: U2.20(STP)
USB_HS_CC1: J3.A5(CC1) R23.1
USB_HS_CC2: J3.B5(CC2) R22.1
USB_HS_D_N: J3.A7(DN1) J3.B7(DN2) RV4.2 U2.5(DM)
USB_HS_D_P: J3.A6(DP1) J3.B6(DP2) RV3.2 U2.6(DP)
USB_HS_VBUS: R20.1 U2.2(VBUS)
USB_NRESET_R: R24.2 U2.22(RESETB)
USB_OSC_OUT: R21.2 X2.3(OUT)
USB_RBIAS: R25.2 U2.24(RBIAS)
VDD3V3: C63.2 U2.4(VDD3.3)

Not connected (* = marked no-connect by the designer): J3 A8(SBU1)* B8(SBU2)*; U2 1(ID)* 7(CPEN)*

### Layout directives
differential pair: USB_HS_D_N, USB_HS_D_P

### Library data of the parts
C58 C59 C61-C63 = CAP_0402: Capacitor SMD 0402; Manufacturer: *; Manufacturer Part Number: *; Distributor Link: *; LCSC: *; Rating: *; Dielectric: *
C60 = CAP_0603: Capacitor SMD 0603; Manufacturer: *; Manufacturer Part Number: *; Distributor Link: *; LCSC: *; Rating: *; Dielectric: *
J3 = GSB1C41110SSHR: as J1 on sheet PowerSupply; Datasheet Link: https://cdn.amphenol-cs.com/media/wysiwyg/files/drawing/gsb1c41x10sshr-ax1.pdf; Height: 3.41mm; Manufacturer_Part_Number: GSB1C41110SSHR
R20-R25 = RES_0402: Resistor SMD 0402; Manufacturer: *; Manufacturer Part Number: *; Distributor Link: *; LCSC: *
RV3 RV4 = CG0402MLU-3.3G: ESD Diode; Manufacturer_Name: Bourns; Datasheet Link: https://www.bourns.com/docs/Product-Datasheets/MLU.pdf; Height: 0.41mm; Manufacturer_Part_Number: CG0402MLU-3.3G; Mouser Part Number: 652-CG0402MLU-3.3G; Mouser Price/Stock: https://www.mouser.co.uk/ProductDetail/Bourns/CG0402MLU-3.3G?qs=m8myXnDJXpWVM8EQWErxtQ%3D%3D; Arrow Part Number: CG0402MLU-3.3G; Arrow Price/Stock: https://www.arrow.com/en/products/cg0402mlu-3.3g/bourns?utm_currency=USD&region=nac
U2 = USB3318C-CP-TR: USB Interface IC High Speed USB 1.8V ULPI; Manufacturer: Microchip; Manufacturer Part Number: USB3318C-CP-TR
X2 = ECS-2520MV-130-BN-TR: Standard Clock Oscillators XO (Standard),13MHz,Standby (Power Down),CMOS, Multi-Volt,1.6 V 3.6 V,+/-50ppm,-40 C 85 C,6mA,Surface Mount,4-SMD, No Lead,(2.50mm x 2.00mm),(0.80mm); Manufacturer: ECS; Manufacturer Part Number: ECS-2520MV-130-BN-TR

## Sheet IsolationBarriers.SchDoc
size A4; SheetNumber: 8; SheetTotal: 9
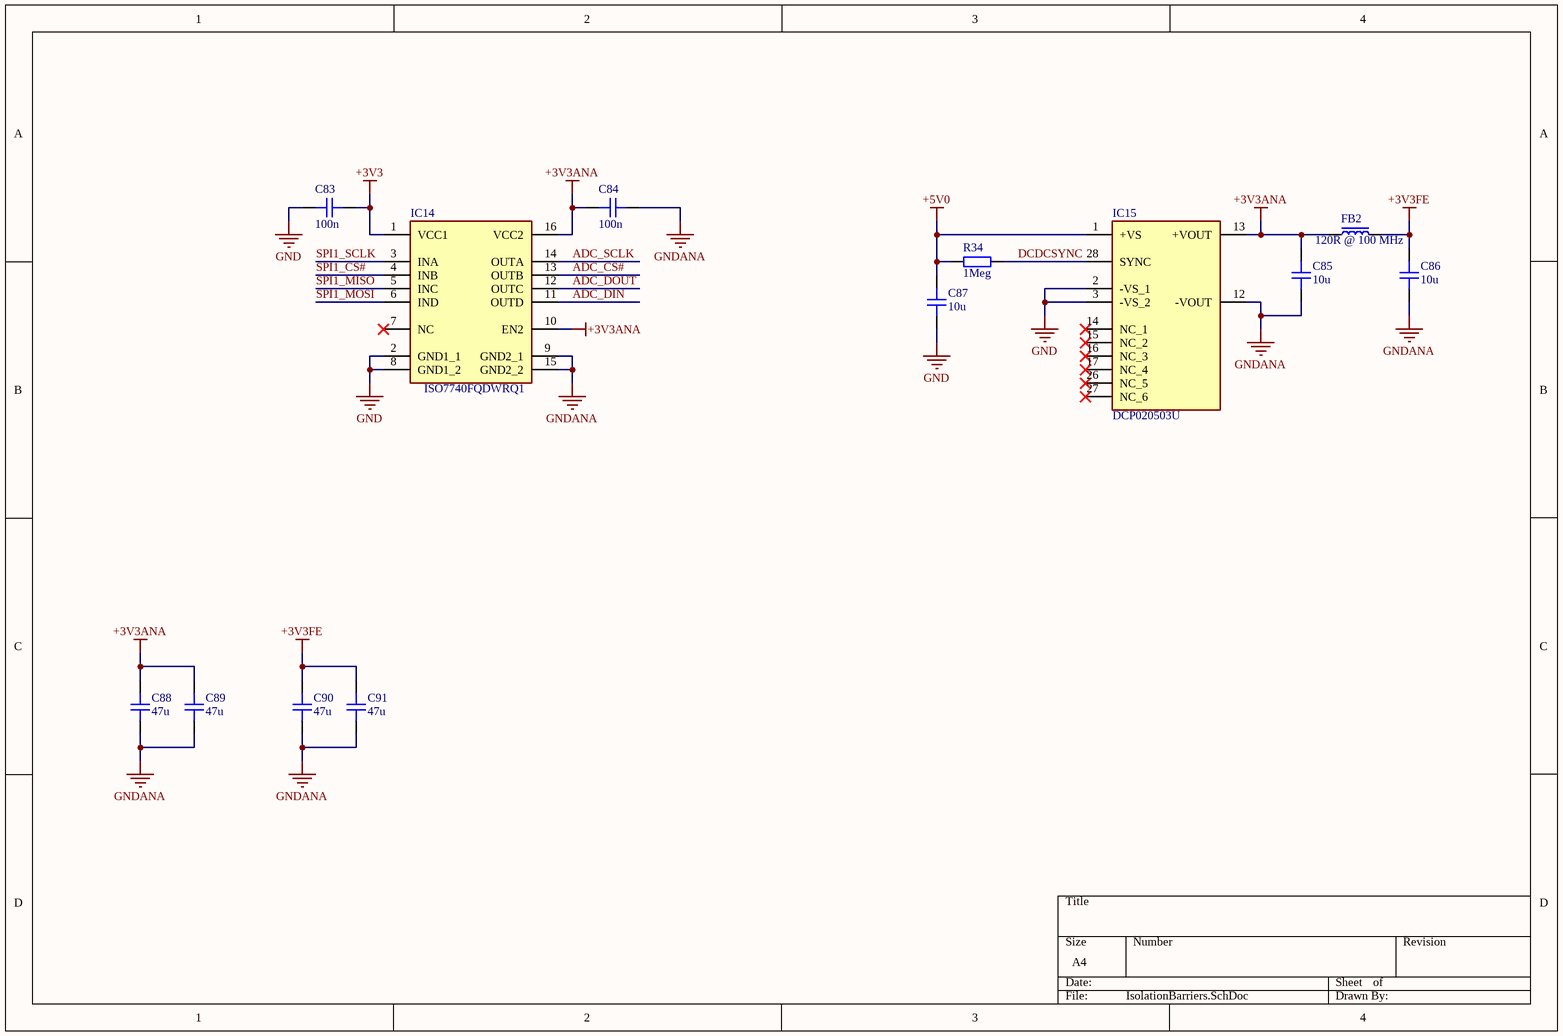
[diagram p7: IsolationBarriers.SchDoc]

### Parts
C83  100n  [CAP_0402]
C84  100n  [CAP_0402]
C85  10u  [CAP_0603]
C86  10u  [CAP_0603]
C87  10u  [CAP_0603]
C88  47u  [CAP_1210]
C89  47u  [CAP_1210]
C90  47u  [CAP_1210]
C91  47u  [CAP_1210]
FB2  120R @ 100 MHz  [FB_0603]
IC14  ISO7740FQDWRQ1  [SOIC127P1030X265-16N]
IC15  DCP020503U  [DVB0012A]
R34  1Meg  [RES_0402]

### Nets
+3V3: C83.1 IC14.1(VCC1)
+3V3ANA: C84.2 C85.2 C88.2 C89.2 FB2.1 IC14.10(EN2) IC14.16(VCC2) IC15.13(+VOUT)
+3V3FE: C86.2 C90.2 C91.2 FB2.2
+5V0: C87.2 IC15.1(+VS) R34.1
GND: C83.2 C87.1 IC14.2(GND1_1) IC14.8(GND1_2) IC15.2(-VS_1) IC15.3(-VS_2)
GNDANA: C84.1 C85.1 C86.1 C88.1 C89.1 C90.1 C91.1 IC14.9(GND2_1) IC14.15(GND2_2) IC15.12(-VOUT)
ADC_CS#: IC14.13(OUTB)
ADC_DIN: IC14.11(OUTD)
ADC_DOUT: IC14.12(OUTC)
ADC_SCLK: IC14.14(OUTA)
DCDCSYNC: IC15.28(SYNC) R34.2
SPI1_CS#: IC14.4(INB)
SPI1_MISO: IC14.5(INC)
SPI1_MOSI: IC14.6(IND)
SPI1_SCLK: IC14.3(INA)

Not connected (* = marked no-connect by the designer): IC14 7(NC)*; IC15 14(NC_1)* 15(NC_2)* 16(NC_3)* 17(NC_4)* 26(NC_5)* 27(NC_6)*

### Library data of the parts
C83 C84 = CAP_0402: Capacitor SMD 0402; Manufacturer: *; Manufacturer Part Number: *; Distributor Link: *; LCSC: *; Rating: *; Dielectric: *
C85-C87 = CAP_0603: Capacitor SMD 0603; Manufacturer: *; Manufacturer Part Number: *; Distributor Link: *; LCSC: *; Rating: *; Dielectric: *
C88-C91 = CAP_1210: Capacitor SMD 1210; Manufacturer: *; Manufacturer Part Number: *; Distributor Link: *; LCSC: *; Rating: *; Dielectric: *
FB2 = FB_0603: Ferrite Bead SMD 0603; Manufacturer: *; Manufacturer Part Number: *; Distributor Link: *; LCSC: *
IC14 = ISO7740FQDWRQ1: Integrated Circuit; Manufacturer_Name: Texas Instruments; Datasheet Link: https://www.ti.com/lit/gpn/iso7740-q1; Height: 2.65mm; Manufacturer_Part_Number: ISO7740FQDWRQ1; Mouser Part Number: 595-ISO7740FQDWRQ1; Mouser Price/Stock: https://www.mouser.co.uk/ProductDetail/Texas-Instruments/ISO7740FQDWRQ1?qs=34RfhUjJmKfM2MieHZI64w%3D%3D; Arrow Part Number: ISO7740FQDWRQ1; Arrow Price/Stock: https://www.arrow.com/en/products/iso7740fqdwrq1/texas-instruments?utm_currency=USD&region=nac
IC15 = DCP020503U: TI Isolated DC DC Converter; Manufacturer_Name: Texas Instruments; Datasheet Link: http://www.ti.com/lit/gpn/dcp020503; Manufacturer_Part_Number: DCP020503U; Mouser Part Number: 595-DCP020503U; Mouser Price/Stock: https://www.mouser.com/Search/Refine.aspx?Keyword=595-DCP020503U; Arrow Part Number: DCP020503U; Arrow Price/Stock: https://www.arrow.com/en/products/dcp020503u/texas-instruments
R34 = RES_0402: Resistor SMD 0402; Manufacturer: *; Manufacturer Part Number: *; Distributor Link: *; LCSC: *

## Sheet MultiChannelADC.SchDoc
size A3; SheetNumber: 9; SheetTotal: 8
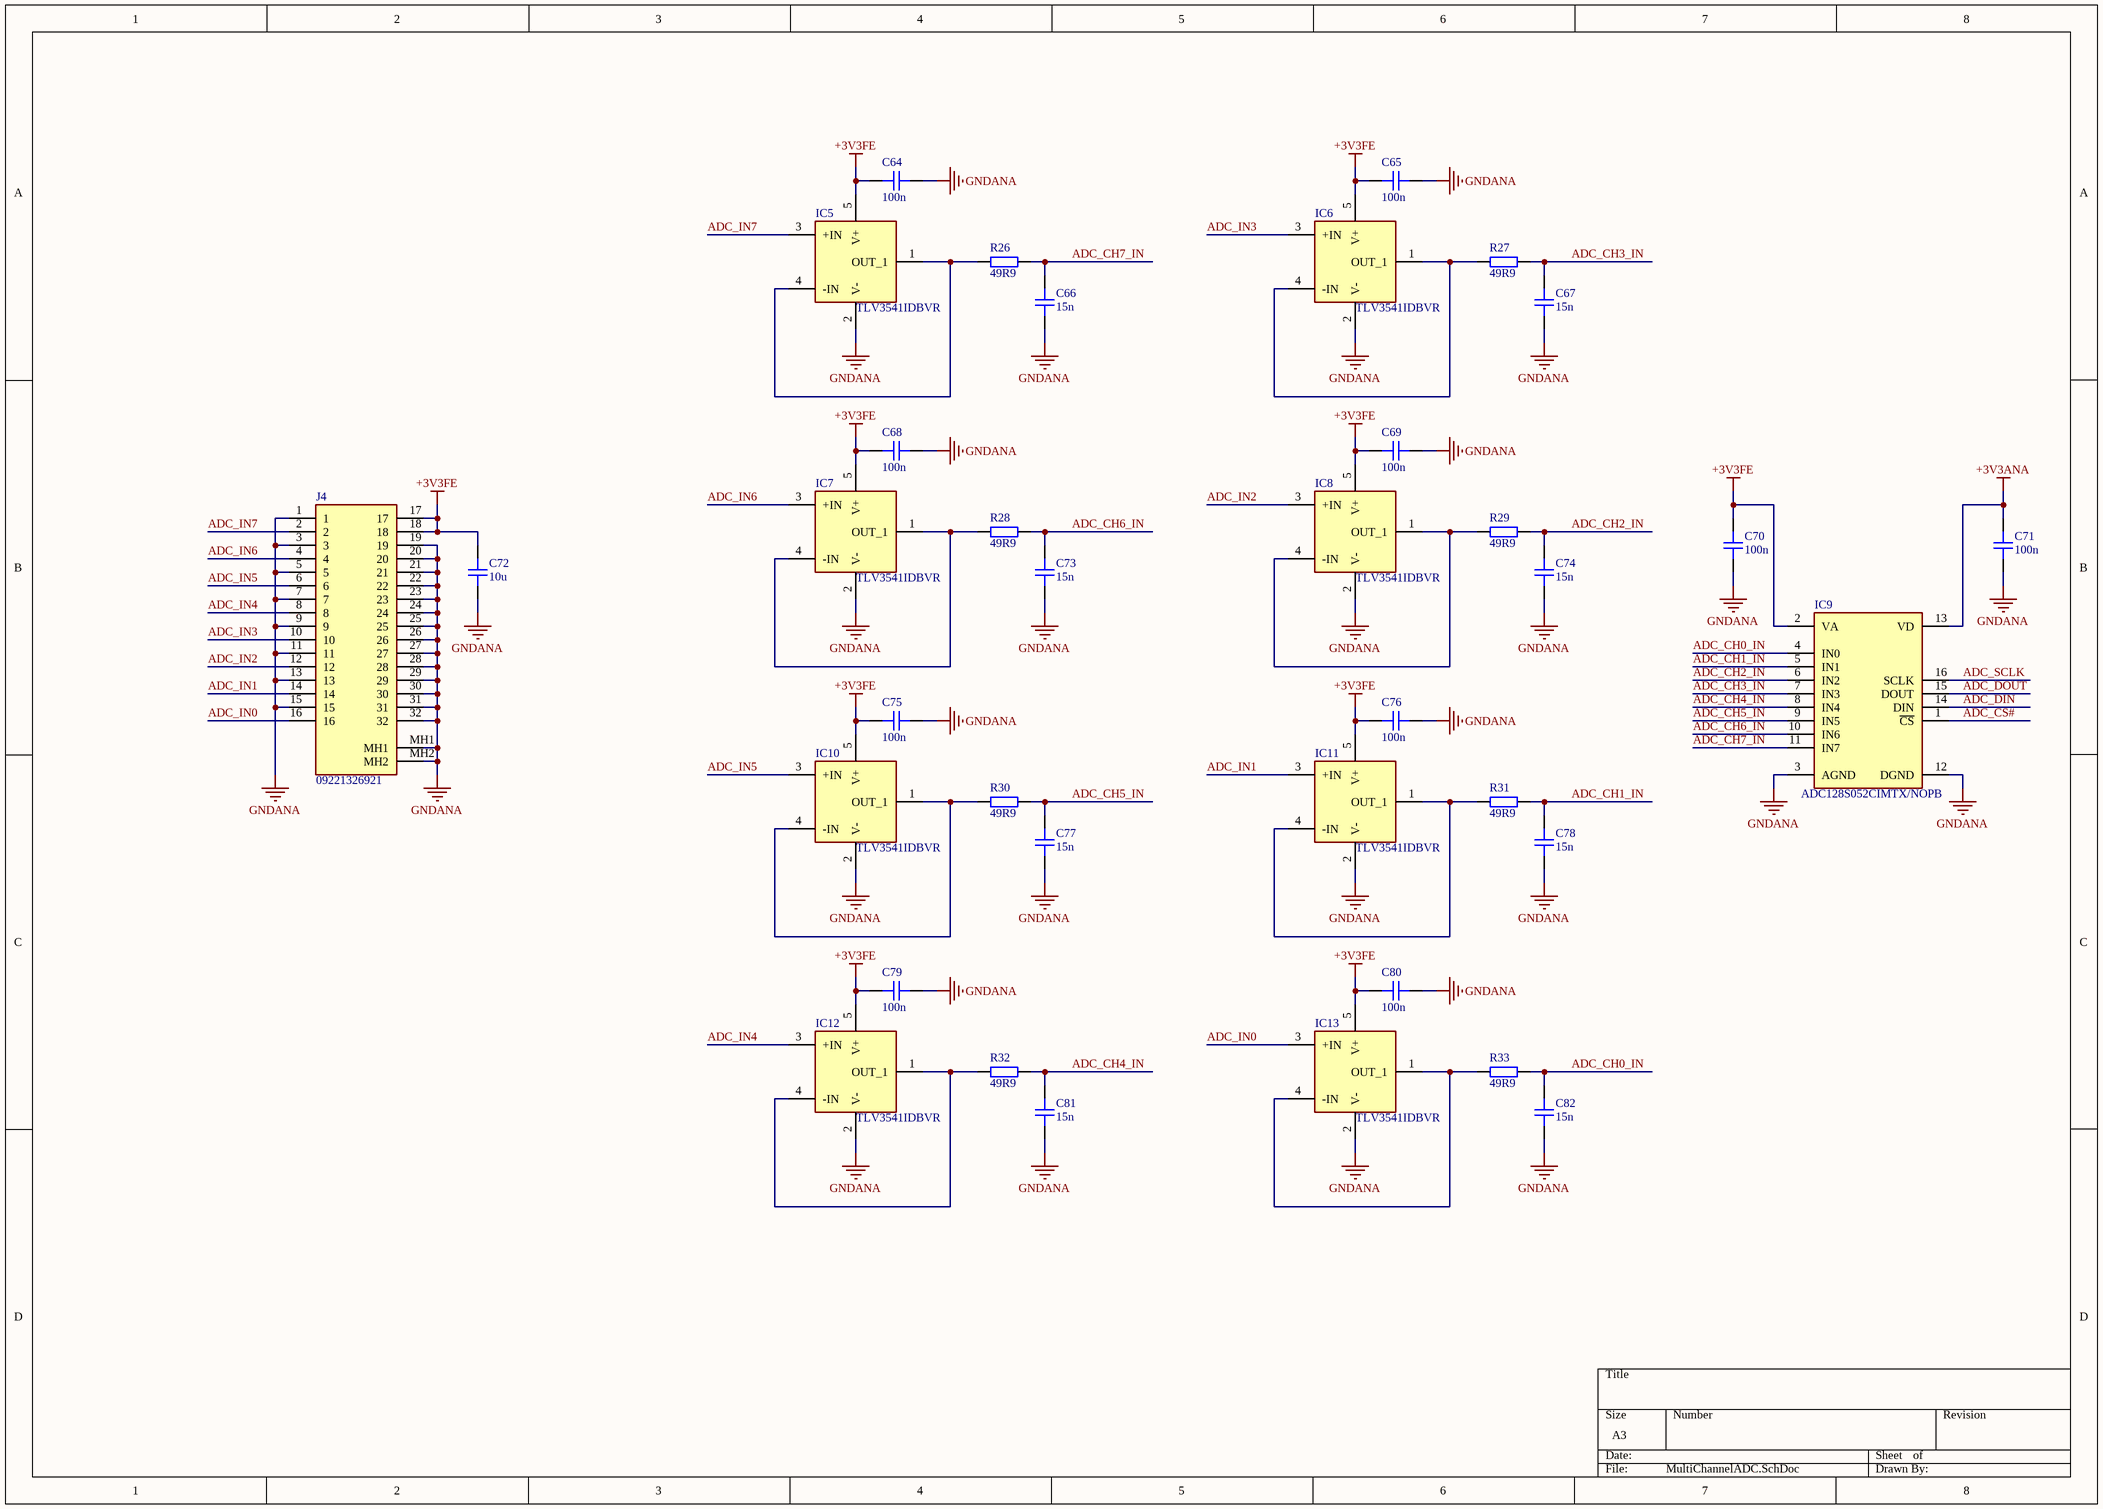
[diagram p8: MultiChannelADC.SchDoc]

### Parts
C64  100n  [CAP_0402]
C65  100n  [CAP_0402]
C66  15n  [CAP_0402]
C67  15n  [CAP_0402]
C68  100n  [CAP_0402]
C69  100n  [CAP_0402]
C70  100n  [CAP_0402]
C71  100n  [CAP_0402]
C72  10u  [CAP_0603]
C73  15n  [CAP_0402]
C74  15n  [CAP_0402]
C75  100n  [CAP_0402]
C76  100n  [CAP_0402]
C77  15n  [CAP_0402]
C78  15n  [CAP_0402]
C79  100n  [CAP_0402]
C80  100n  [CAP_0402]
C81  15n  [CAP_0402]
C82  15n  [CAP_0402]
IC5  TLV3541IDBVR  [SOT95P280X145-5N - duplicate]
IC6  TLV3541IDBVR  [SOT95P280X145-5N - duplicate]
IC7  TLV3541IDBVR  [SOT95P280X145-5N - duplicate]
IC8  TLV3541IDBVR  [SOT95P280X145-5N - duplicate]
IC9  ADC128S052CIMTX/NOPB  [SOP65P640X120-16N]
IC10  TLV3541IDBVR  [SOT95P280X145-5N - duplicate]
IC11  TLV3541IDBVR  [SOT95P280X145-5N - duplicate]
IC12  TLV3541IDBVR  [SOT95P280X145-5N - duplicate]
IC13  TLV3541IDBVR  [SOT95P280X145-5N - duplicate]
J4  09221326921  [09221326921]
R26  49R9  [RES_0402]
R27  49R9  [RES_0402]
R28  49R9  [RES_0402]
R29  49R9  [RES_0402]
R30  49R9  [RES_0402]
R31  49R9  [RES_0402]
R32  49R9  [RES_0402]
R33  49R9  [RES_0402]

### Nets
+3V3ANA: C71.2 IC9.13(VD)
+3V3FE: C64.2 C65.2 C68.2 C69.2 C70.2 C72.2 C75.2 C76.2 C79.2 C80.2 IC5.5(V+) IC6.5(V+) IC7.5(V+) IC8.5(V+) IC9.2(VA) IC10.5(V+) IC11.5(V+) IC12.5(V+) IC13.5(V+) J4.17 J4.18
GNDANA: C64.1 C65.1 C66.1 C67.1 C68.1 C69.1 C70.1 C71.1 C72.1 C73.1 C74.1 C75.1 C76.1 C77.1 C78.1 C79.1 C80.1 C81.1 C82.1 IC5.2(V-) IC6.2(V-) IC7.2(V-) IC8.2(V-) IC9.3(AGND) IC9.12(DGND) IC10.2(V-) IC11.2(V-) IC12.2(V-) IC13.2(V-) J4.1 J4.3 J4.5 J4.7 J4.9 J4.11 J4.13 J4.15 J4.19 J4.20 J4.21 J4.22 J4.23 J4.24 J4.25 J4.26 J4.27 J4.28 J4.29 J4.30 J4.31 J4.32 J4.MH1 J4.MH2
ADC_CH0_IN: C82.2 IC9.4(IN0) R33.2
ADC_CH1_IN: C78.2 IC9.5(IN1) R31.2
ADC_CH2_IN: C74.2 IC9.6(IN2) R29.2
ADC_CH3_IN: C67.2 IC9.7(IN3) R27.2
ADC_CH4_IN: C81.2 IC9.8(IN4) R32.2
ADC_CH5_IN: C77.2 IC9.9(IN5) R30.2
ADC_CH6_IN: C73.2 IC9.10(IN6) R28.2
ADC_CH7_IN: C66.2 IC9.11(IN7) R26.2
ADC_CS#: IC9.1(~{CS})
ADC_DIN: IC9.14(DIN)
ADC_DOUT: IC9.15(DOUT)
ADC_IN0: IC13.3(+IN) J4.16
ADC_IN1: IC11.3(+IN) J4.14
ADC_IN2: IC8.3(+IN) J4.12
ADC_IN3: IC6.3(+IN) J4.10
ADC_IN4: IC12.3(+IN) J4.8
ADC_IN5: IC10.3(+IN) J4.6
ADC_IN6: IC7.3(+IN) J4.4
ADC_IN7: IC5.3(+IN) J4.2
ADC_SCLK: IC9.16(SCLK)
NetIC5_1: IC5.1(OUT_1) IC5.4(-IN) R26.1
NetIC6_1: IC6.1(OUT_1) IC6.4(-IN) R27.1
NetIC7_1: IC7.1(OUT_1) IC7.4(-IN) R28.1
NetIC8_1: IC8.1(OUT_1) IC8.4(-IN) R29.1
NetIC10_1: IC10.1(OUT_1) IC10.4(-IN) R30.1
NetIC11_1: IC11.1(OUT_1) IC11.4(-IN) R31.1
NetIC12_1: IC12.1(OUT_1) IC12.4(-IN) R32.1
NetIC13_1: IC13.1(OUT_1) IC13.4(-IN) R33.1

### Library data of the parts
C64-C71 C73-C82 = CAP_0402: Capacitor SMD 0402; Manufacturer: *; Manufacturer Part Number: *; Distributor Link: *; LCSC: *; Rating: *; Dielectric: *
C72 = CAP_0603: Capacitor SMD 0603; Manufacturer: *; Manufacturer Part Number: *; Distributor Link: *; LCSC: *; Rating: *; Dielectric: *
IC5-IC8 IC10-IC13 = TLV3541IDBVR: Integrated Circuit; Manufacturer_Name: Texas Instruments; Datasheet Link: http://www.ti.com/lit/gpn/tlv3541; Height: 1.45mm; Manufacturer_Part_Number: TLV3541IDBVR; Mouser Part Number: 595-TLV3541IDBVR; Mouser Price/Stock: https://www.mouser.co.uk/ProductDetail/Texas-Instruments/TLV3541IDBVR?qs=9lcNTSmDlCoQ%2FjlOWHAJGw%3D%3D; Arrow Part Number: TLV3541IDBVR; Arrow Price/Stock: https://www.arrow.com/en/products/tlv3541idbvr/texas-instruments?region=nac
IC9 = ADC128S052CIMTX/NOPB: Texas Instruments 8 Channel A/D-Converter 500 kSP/S; Datasheet Link: http://www.ti.com/lit/ds/symlink/adc128s052.pdf; Height: 1.2mm; Manufacturer_Name: Texas Instruments; Manufacturer_Part_Number: ADC128S052CIMTX/NOPB; Mouser Part Number: 926-A128S052CIMTXNPB; Mouser Price/Stock: https://www.mouser.com/Search/Refine.aspx?Keyword=926-A128S052CIMTXNPB; Arrow Part Number: ADC128S052CIMTX/NOPB; Arrow Price/Stock: https://www.arrow.com/en/products/adc128s052cimtxnopb/texas-instruments
J4 = 09221326921: Connector; Manufacturer_Name: HARTING; Datasheet Link: https://b2b.harting.com/files/download/PRD/PDF_DS/PDF_DS_09031200201.pdf; Height: 8.5mm; Manufacturer_Part_Number: 09221326921; Mouser Part Number: 617-09-22-132-6921; Mouser Price/Stock: https://www.mouser.co.uk/ProductDetail/HARTING/09221326921?qs=qa49y27LPCH2CheOb1uPAg%3D%3D; Arrow Part Number: 09221326921; Arrow Price/Stock: https://www.arrow.com/en/products/09221326921/harting?region=nac
R26-R33 = RES_0402: Resistor SMD 0402; Manufacturer: *; Manufacturer Part Number: *; Distributor Link: *; LCSC: *

## Nets that join several sheets
+1V8: PowerSupply (C11.2 C12.2 L2.2 R8.2), USBHSULPI (C58.2 U2.21)
+3V3: PowerSupply (6 pins), Decoupling (50 pins), MCUConfig (6 pins), SDRAMModule (14 pins), USBHSULPI (8 pins), IsolationBarriers (C83.1 IC14.1)
+3V3ANA: IsolationBarriers (8 pins), MultiChannelADC (C71.2 IC9.13)
+3V3FE: IsolationBarriers (C86.2 C90.2 C91.2 FB2.2), MultiChannelADC (21 pins)
+5V0: PowerSupply (13 pins), IsolationBarriers (C87.2 IC15.1 R34.1)
GND: PowerSupply (28 pins), Decoupling (56 pins), MCUConfig (11 pins), SDRAMModule (14 pins), USBHSULPI (19 pins), IsolationBarriers (6 pins)
GNDANA: IsolationBarriers (10 pins), MultiChannelADC (53 pins)
ADC_CS#: IsolationBarriers (IC14.13), MultiChannelADC (IC9.1)
ADC_DIN: IsolationBarriers (IC14.11), MultiChannelADC (IC9.14)
ADC_DOUT: IsolationBarriers (IC14.12), MultiChannelADC (IC9.15)
ADC_SCLK: IsolationBarriers (IC14.14), MultiChannelADC (IC9.16)
FMC_A0: SDRAMModule (IC4.23), GPIOPins (IC3.18)
FMC_A1: SDRAMModule (IC4.24), GPIOPins (IC3.19)
FMC_A2: SDRAMModule (IC4.25), GPIOPins (IC3.20)
FMC_A3: SDRAMModule (IC4.26), GPIOPins (IC3.21)
FMC_A4: SDRAMModule (IC4.29), GPIOPins (IC3.22)
FMC_A5: SDRAMModule (IC4.30), GPIOPins (IC3.23)
FMC_A6: SDRAMModule (IC4.31), GPIOPins (IC3.59)
FMC_A7: SDRAMModule (IC4.32), GPIOPins (IC3.60)
FMC_A8: SDRAMModule (IC4.33), GPIOPins (IC3.61)
FMC_A9: SDRAMModule (IC4.34), GPIOPins (IC3.62)
FMC_A10: SDRAMModule (IC4.22), GPIOPins (IC3.63)
FMC_A11: SDRAMModule (IC4.35), GPIOPins (IC3.66)
FMC_BA0: SDRAMModule (IC4.20), GPIOPins (IC3.114)
FMC_BA1: SDRAMModule (IC4.21), GPIOPins (IC3.115)
FMC_D0: SDRAMModule (IC4.2), GPIOPins (IC3.97)
FMC_D1: SDRAMModule (IC4.4), GPIOPins (IC3.98)
FMC_D2: SDRAMModule (IC4.5), GPIOPins (IC3.143)
FMC_D3: SDRAMModule (IC4.7), GPIOPins (IC3.144)
FMC_D4: SDRAMModule (IC4.8), GPIOPins (IC3.67)
FMC_D5: SDRAMModule (IC4.10), GPIOPins (IC3.68)
FMC_D6: SDRAMModule (IC4.11), GPIOPins (IC3.69)
FMC_D7: SDRAMModule (IC4.13), GPIOPins (IC3.72)
FMC_D8: SDRAMModule (IC4.42), GPIOPins (IC3.73)
FMC_D9: SDRAMModule (IC4.44), GPIOPins (IC3.74)
FMC_D10: SDRAMModule (IC4.45), GPIOPins (IC3.75)
FMC_D11: SDRAMModule (IC4.47), GPIOPins (IC3.76)
FMC_D12: SDRAMModule (IC4.48), GPIOPins (IC3.77)
FMC_D13: SDRAMModule (IC4.50), GPIOPins (IC3.89)
FMC_D14: SDRAMModule (IC4.51), GPIOPins (IC3.90)
FMC_D15: SDRAMModule (IC4.53), GPIOPins (IC3.91)
FMC_NBL0: SDRAMModule (IC4.15), GPIOPins (IC3.170)
FMC_NBL1: SDRAMModule (IC4.39), GPIOPins (IC3.171)
FMC_SDCKE0: SDRAMModule (IC4.37), GPIOPins (IC3.54)
FMC_SDCLK: SDRAMModule (IC4.38), GPIOPins (IC3.118)
FMC_SDNCAS: SDRAMModule (IC4.17), GPIOPins (IC3.161)
FMC_SDNE0: SDRAMModule (IC4.19), GPIOPins (IC3.53)
FMC_SDNRAS: SDRAMModule (IC4.18), GPIOPins (IC3.58)
FMC_SDNWE: SDRAMModule (IC4.16), GPIOPins (IC3.52)
QSPI_CLK: MCUConfig (U1.6), GPIOPins (IC3.30)
QSPI_CS#: MCUConfig (U1.1), GPIOPins (IC3.165)
QSPI_IO0: MCUConfig (U1.5), GPIOPins (IC3.28)
QSPI_IO1: MCUConfig (U1.2), GPIOPins (IC3.29)
QSPI_IO2: MCUConfig (U1.3), GPIOPins (IC3.27)
QSPI_IO3: MCUConfig (U1.7), GPIOPins (IC3.26)
SPI1_CS#: GPIOPins (IC3.154), IsolationBarriers (IC14.4)
SPI1_MISO: GPIOPins (IC3.153), IsolationBarriers (IC14.5)
SPI1_MOSI: GPIOPins (IC3.150), IsolationBarriers (IC14.6)
SPI1_SCLK: GPIOPins (IC3.155), IsolationBarriers (IC14.3)
SWCLK: MCUConfig (D2.29 J2.4), GPIOPins (R19.1)
SWDIO: MCUConfig (D2.110 J2.2), GPIOPins (R18.1)
SWO: MCUConfig (D2.47 J2.6), GPIOPins (R17.1)
ULPI_CLK: GPIOPins (IC3.50), USBHSULPI (U2.12)
ULPI_D0: GPIOPins (IC3.46), USBHSULPI (U2.16)
ULPI_D1: GPIOPins (IC3.55), USBHSULPI (U2.15)
ULPI_D2: GPIOPins (IC3.56), USBHSULPI (U2.14)
ULPI_D3: GPIOPins (IC3.78), USBHSULPI (U2.13)
ULPI_D4: GPIOPins (IC3.79), USBHSULPI (U2.11)
ULPI_D5: GPIOPins (IC3.85), USBHSULPI (U2.10)
ULPI_D6: GPIOPins (IC3.86), USBHSULPI (U2.9)
ULPI_D7: GPIOPins (IC3.164), USBHSULPI (U2.8)
ULPI_DIR: GPIOPins (IC3.36), USBHSULPI (U2.19)
ULPI_NXT: GPIOPins (IC3.37), USBHSULPI (U2.18)
ULPI_STP: GPIOPins (IC3.34), USBHSULPI (U2.20)
USB_FS_D_N: PowerSupply (J1.A7 J1.B7 RV2.2), GPIOPins (IC3.130)
USB_FS_D_P: PowerSupply (J1.A6 J1.B6 RV1.2), GPIOPins (IC3.131)
USB_NRESET_R: GPIOPins (IC3.51), USBHSULPI (R24.2 U2.22)